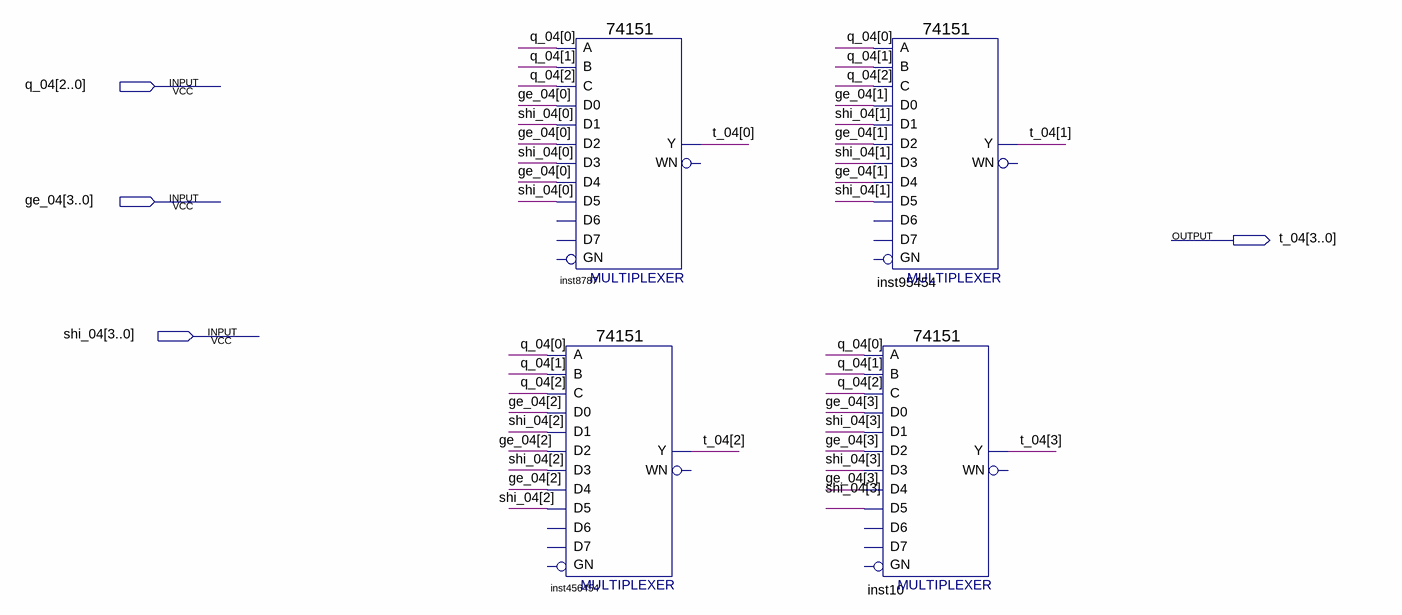
[diagram p0: schematic sheet]
// Quartus schematic code_select.bdf as structural Verilog: 4 symbols, 4 pins
module code_select (
  input  [2:0] q_04,
  input  [3:0] ge_04,
  input  [3:0] shi_04,
  output [3:0] t_04
);

  \74151  inst8787 (
    .C(q_04[2]), .B(q_04[1]), .A(q_04[0]), .D5(shi_04[0]), .D0(ge_04[0]), .D1(shi_04[0]), .D4(ge_04[0]),
    .D3(shi_04[0]), .D2(ge_04[0]), .Y(t_04[0]));  // open: GN, D6, D7, WN
  \74151  inst456454 (
    .C(q_04[2]), .B(q_04[1]), .A(q_04[0]), .D5(shi_04[2]), .D0(ge_04[2]), .D1(shi_04[2]), .D4(ge_04[2]),
    .D3(shi_04[2]), .D2(ge_04[2]), .Y(t_04[2]));  // open: GN, D6, D7, WN
  \74151  inst95454 (
    .C(q_04[2]), .B(q_04[1]), .A(q_04[0]), .D5(shi_04[1]), .D0(ge_04[1]), .D1(shi_04[1]), .D4(ge_04[1]),
    .D3(shi_04[1]), .D2(ge_04[1]), .Y(t_04[1]));  // open: GN, D6, D7, WN
  \74151  inst10 (
    .C(q_04[2]), .B(q_04[1]), .A(q_04[0]), .D5(shi_04[3]), .D0(ge_04[3]), .D1(shi_04[3]), .D4(ge_04[3]),
    .D3(shi_04[3]), .D2(ge_04[3]), .Y(t_04[3]));  // open: GN, D6, D7, WN
endmodule
